# EasyEDA schematic SCH_The-Trail-Radio_2024-05-21.json
TITLE: Communication device; REV: 1.1; Date: 2024-05-07; Sheet: 1/1; Drawn By: J & Evan; Company: Hack club!
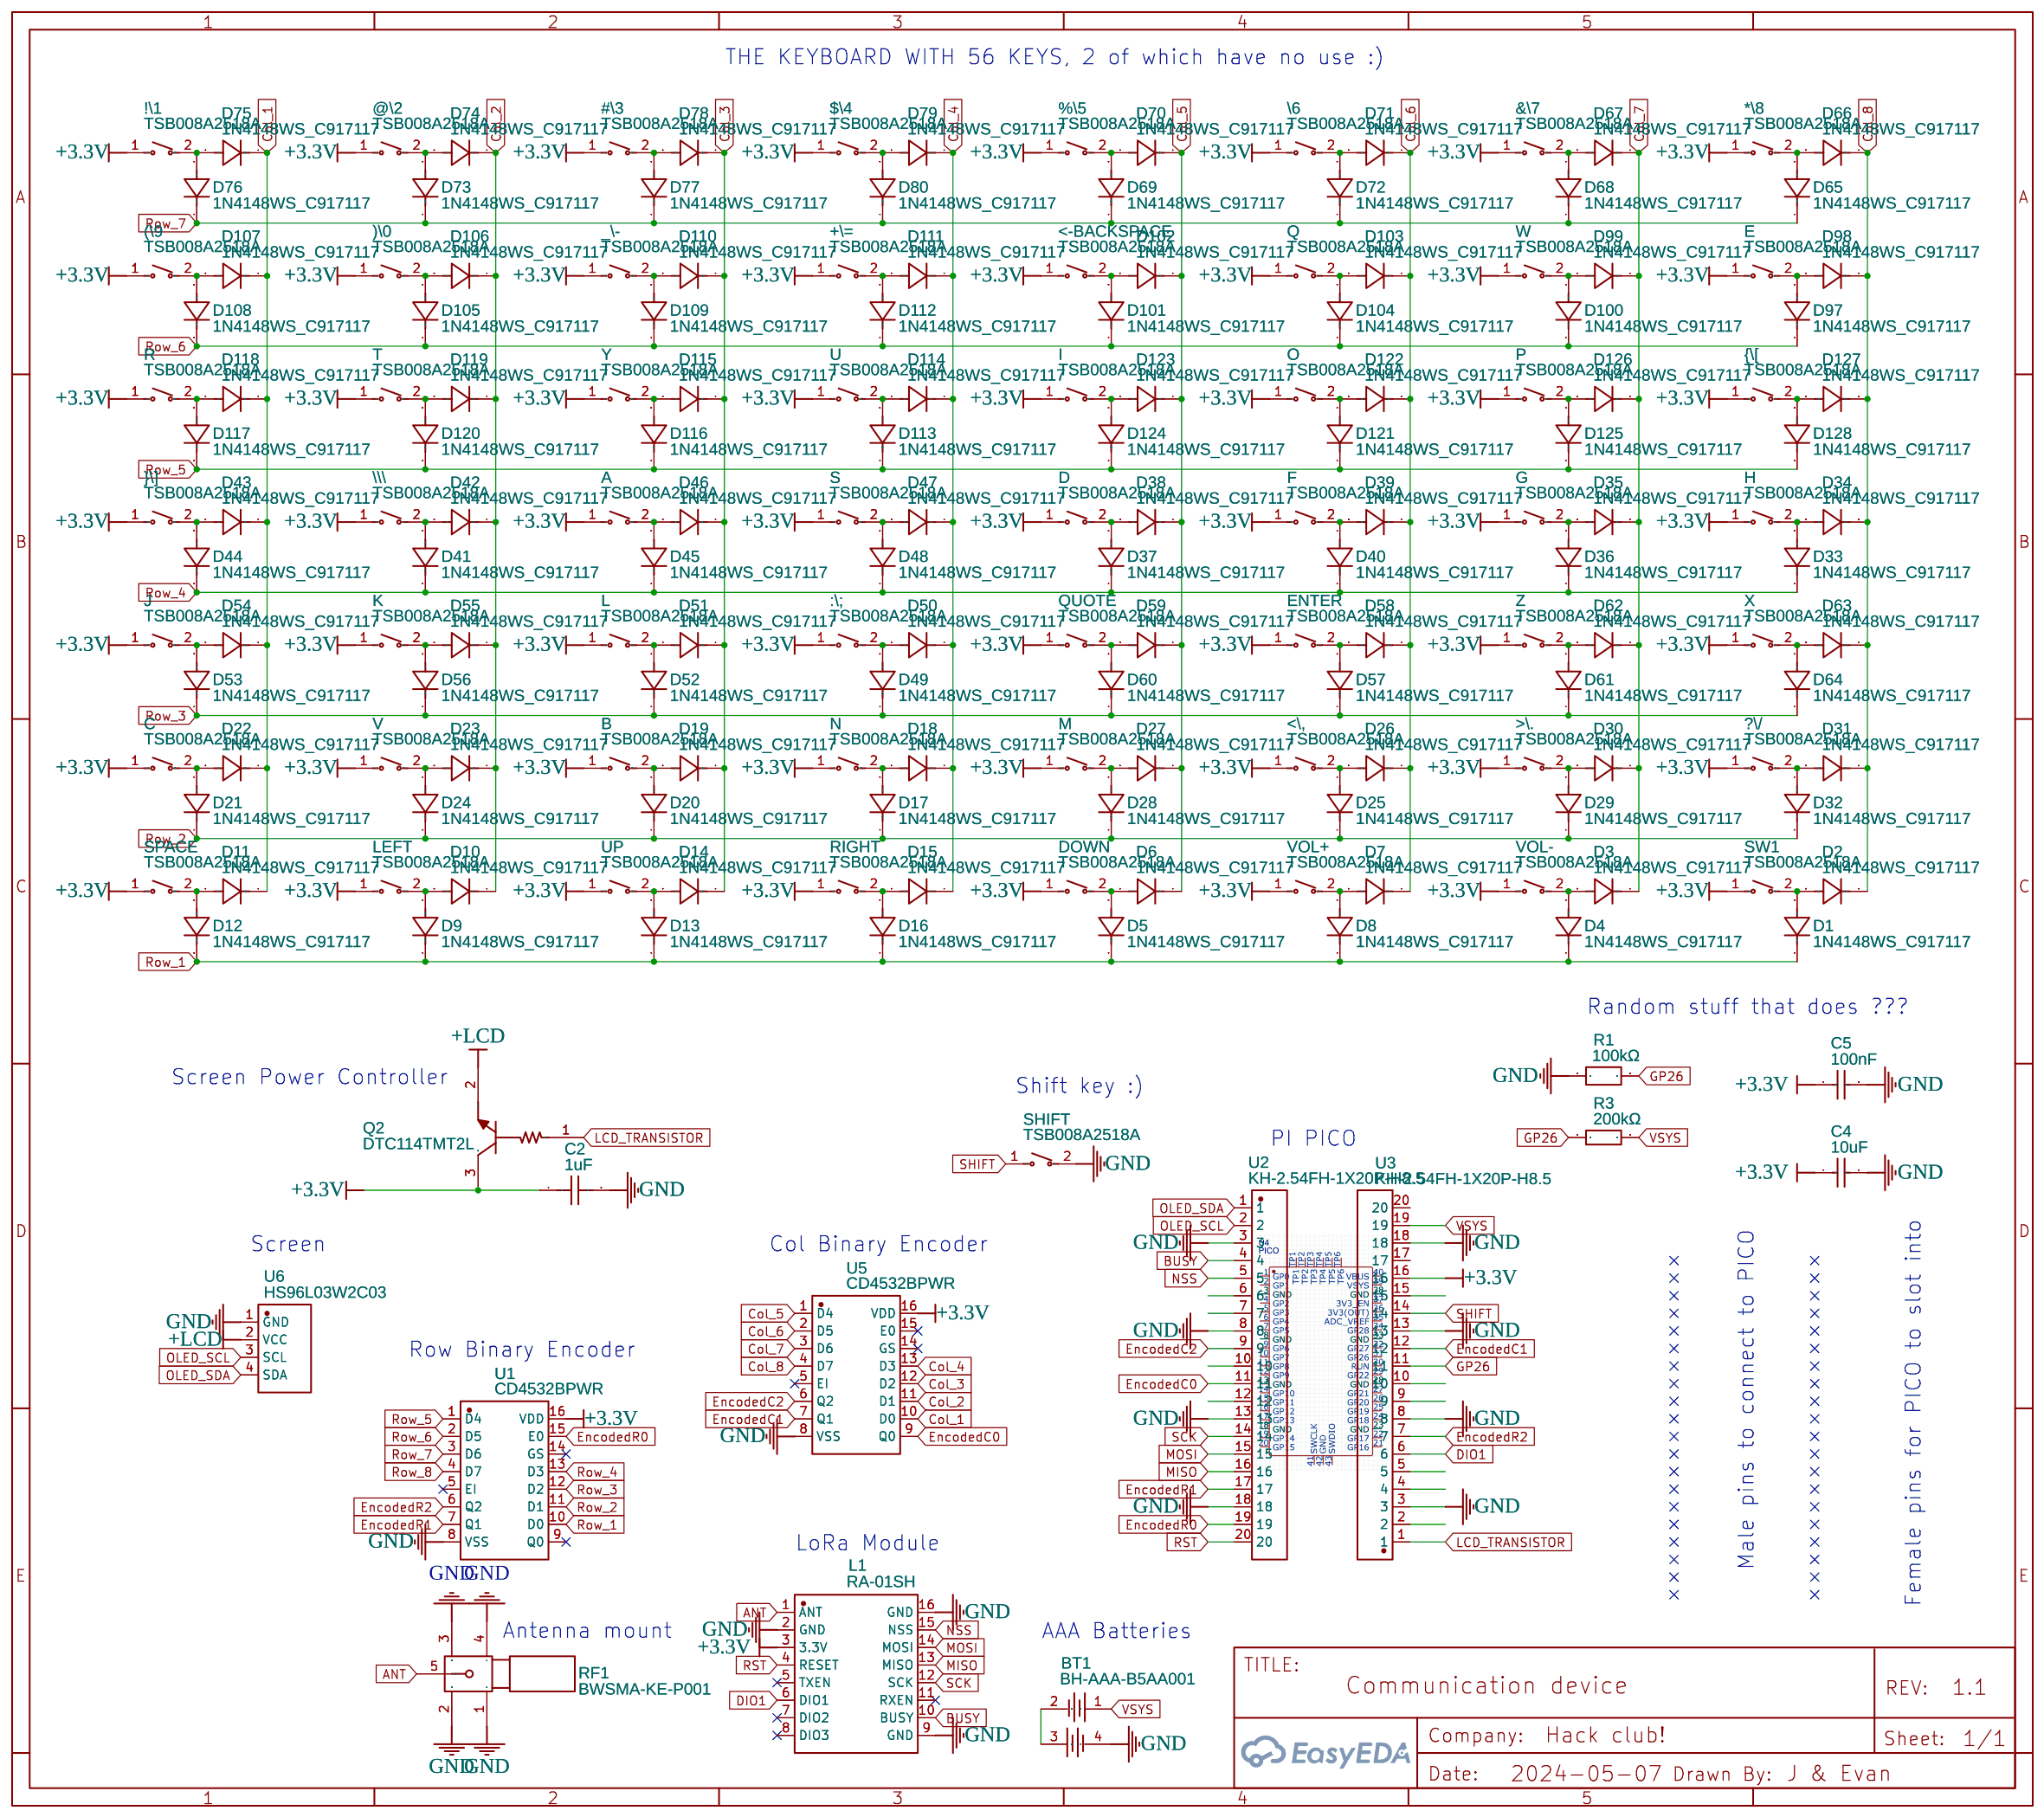
[diagram p0: schematic sheet]

## Parts
!\1  TSB008A2518A  [SW-SMD_L6.0-W3.5-LS8.2]
#\3  TSB008A2518A  [SW-SMD_L6.0-W3.5-LS8.2]
$\4  TSB008A2518A  [SW-SMD_L6.0-W3.5-LS8.2]
%\5  TSB008A2518A  [SW-SMD_L6.0-W3.5-LS8.2]
&\7  TSB008A2518A  [SW-SMD_L6.0-W3.5-LS8.2]
(\9  TSB008A2518A  [SW-SMD_L6.0-W3.5-LS8.2]
)\0  TSB008A2518A  [SW-SMD_L6.0-W3.5-LS8.2]
*\8  TSB008A2518A  [SW-SMD_L6.0-W3.5-LS8.2]
+\=  TSB008A2518A  [SW-SMD_L6.0-W3.5-LS8.2]
:\;  TSB008A2518A  [SW-SMD_L6.0-W3.5-LS8.2]
<-BACKSPACE  TSB008A2518A  [SW-SMD_L6.0-W3.5-LS8.2]
<\,  TSB008A2518A  [SW-SMD_L6.0-W3.5-LS8.2]
>\.  TSB008A2518A  [SW-SMD_L6.0-W3.5-LS8.2]
?\/  TSB008A2518A  [SW-SMD_L6.0-W3.5-LS8.2]
@\2  TSB008A2518A  [SW-SMD_L6.0-W3.5-LS8.2]
\6  TSB008A2518A  [SW-SMD_L6.0-W3.5-LS8.2]
\\\  TSB008A2518A  [SW-SMD_L6.0-W3.5-LS8.2]
_\-  TSB008A2518A  [SW-SMD_L6.0-W3.5-LS8.2]
A  TSB008A2518A  [SW-SMD_L6.0-W3.5-LS8.2]
B  TSB008A2518A  [SW-SMD_L6.0-W3.5-LS8.2]
BT1  BH-AAA-B5AA001  [BAT-SMD_BH-AAA-B5AA001]
C  TSB008A2518A  [SW-SMD_L6.0-W3.5-LS8.2]
C2  1uF  [C0402]
C4  10uF  [C0402]
C5  100nF  [C0402]
D  TSB008A2518A  [SW-SMD_L6.0-W3.5-LS8.2]
D1  1N4148WS_C917117  [SOD-323_L1.8-W1.3-LS2.5-RD]
D2  1N4148WS_C917117  [SOD-323_L1.8-W1.3-LS2.5-RD]
D3  1N4148WS_C917117  [SOD-323_L1.8-W1.3-LS2.5-RD]
D4  1N4148WS_C917117  [SOD-323_L1.8-W1.3-LS2.5-RD]
D5  1N4148WS_C917117  [SOD-323_L1.8-W1.3-LS2.5-RD]
D6  1N4148WS_C917117  [SOD-323_L1.8-W1.3-LS2.5-RD]
D7  1N4148WS_C917117  [SOD-323_L1.8-W1.3-LS2.5-RD]
D8  1N4148WS_C917117  [SOD-323_L1.8-W1.3-LS2.5-RD]
D9  1N4148WS_C917117  [SOD-323_L1.8-W1.3-LS2.5-RD]
D10  1N4148WS_C917117  [SOD-323_L1.8-W1.3-LS2.5-RD]
D11  1N4148WS_C917117  [SOD-323_L1.8-W1.3-LS2.5-RD]
D12  1N4148WS_C917117  [SOD-323_L1.8-W1.3-LS2.5-RD]
D13  1N4148WS_C917117  [SOD-323_L1.8-W1.3-LS2.5-RD]
D14  1N4148WS_C917117  [SOD-323_L1.8-W1.3-LS2.5-RD]
D15  1N4148WS_C917117  [SOD-323_L1.8-W1.3-LS2.5-RD]
D16  1N4148WS_C917117  [SOD-323_L1.8-W1.3-LS2.5-RD]
D17  1N4148WS_C917117  [SOD-323_L1.8-W1.3-LS2.5-RD]
D18  1N4148WS_C917117  [SOD-323_L1.8-W1.3-LS2.5-RD]
D19  1N4148WS_C917117  [SOD-323_L1.8-W1.3-LS2.5-RD]
D20  1N4148WS_C917117  [SOD-323_L1.8-W1.3-LS2.5-RD]
D21  1N4148WS_C917117  [SOD-323_L1.8-W1.3-LS2.5-RD]
D22  1N4148WS_C917117  [SOD-323_L1.8-W1.3-LS2.5-RD]
D23  1N4148WS_C917117  [SOD-323_L1.8-W1.3-LS2.5-RD]
D24  1N4148WS_C917117  [SOD-323_L1.8-W1.3-LS2.5-RD]
D25  1N4148WS_C917117  [SOD-323_L1.8-W1.3-LS2.5-RD]
D26  1N4148WS_C917117  [SOD-323_L1.8-W1.3-LS2.5-RD]
D27  1N4148WS_C917117  [SOD-323_L1.8-W1.3-LS2.5-RD]
D28  1N4148WS_C917117  [SOD-323_L1.8-W1.3-LS2.5-RD]
D29  1N4148WS_C917117  [SOD-323_L1.8-W1.3-LS2.5-RD]
D30  1N4148WS_C917117  [SOD-323_L1.8-W1.3-LS2.5-RD]
D31  1N4148WS_C917117  [SOD-323_L1.8-W1.3-LS2.5-RD]
D32  1N4148WS_C917117  [SOD-323_L1.8-W1.3-LS2.5-RD]
D33  1N4148WS_C917117  [SOD-323_L1.8-W1.3-LS2.5-RD]
D34  1N4148WS_C917117  [SOD-323_L1.8-W1.3-LS2.5-RD]
D35  1N4148WS_C917117  [SOD-323_L1.8-W1.3-LS2.5-RD]
D36  1N4148WS_C917117  [SOD-323_L1.8-W1.3-LS2.5-RD]
D37  1N4148WS_C917117  [SOD-323_L1.8-W1.3-LS2.5-RD]
D38  1N4148WS_C917117  [SOD-323_L1.8-W1.3-LS2.5-RD]
D39  1N4148WS_C917117  [SOD-323_L1.8-W1.3-LS2.5-RD]
D40  1N4148WS_C917117  [SOD-323_L1.8-W1.3-LS2.5-RD]
D41  1N4148WS_C917117  [SOD-323_L1.8-W1.3-LS2.5-RD]
D42  1N4148WS_C917117  [SOD-323_L1.8-W1.3-LS2.5-RD]
D43  1N4148WS_C917117  [SOD-323_L1.8-W1.3-LS2.5-RD]
D44  1N4148WS_C917117  [SOD-323_L1.8-W1.3-LS2.5-RD]
D45  1N4148WS_C917117  [SOD-323_L1.8-W1.3-LS2.5-RD]
D46  1N4148WS_C917117  [SOD-323_L1.8-W1.3-LS2.5-RD]
D47  1N4148WS_C917117  [SOD-323_L1.8-W1.3-LS2.5-RD]
D48  1N4148WS_C917117  [SOD-323_L1.8-W1.3-LS2.5-RD]
D49  1N4148WS_C917117  [SOD-323_L1.8-W1.3-LS2.5-RD]
D50  1N4148WS_C917117  [SOD-323_L1.8-W1.3-LS2.5-RD]
D51  1N4148WS_C917117  [SOD-323_L1.8-W1.3-LS2.5-RD]
D52  1N4148WS_C917117  [SOD-323_L1.8-W1.3-LS2.5-RD]
D53  1N4148WS_C917117  [SOD-323_L1.8-W1.3-LS2.5-RD]
D54  1N4148WS_C917117  [SOD-323_L1.8-W1.3-LS2.5-RD]
D55  1N4148WS_C917117  [SOD-323_L1.8-W1.3-LS2.5-RD]
D56  1N4148WS_C917117  [SOD-323_L1.8-W1.3-LS2.5-RD]
D57  1N4148WS_C917117  [SOD-323_L1.8-W1.3-LS2.5-RD]
D58  1N4148WS_C917117  [SOD-323_L1.8-W1.3-LS2.5-RD]
D59  1N4148WS_C917117  [SOD-323_L1.8-W1.3-LS2.5-RD]
D60  1N4148WS_C917117  [SOD-323_L1.8-W1.3-LS2.5-RD]
D61  1N4148WS_C917117  [SOD-323_L1.8-W1.3-LS2.5-RD]
D62  1N4148WS_C917117  [SOD-323_L1.8-W1.3-LS2.5-RD]
D63  1N4148WS_C917117  [SOD-323_L1.8-W1.3-LS2.5-RD]
D64  1N4148WS_C917117  [SOD-323_L1.8-W1.3-LS2.5-RD]
D65  1N4148WS_C917117  [SOD-323_L1.8-W1.3-LS2.5-RD]
D66  1N4148WS_C917117  [SOD-323_L1.8-W1.3-LS2.5-RD]
D67  1N4148WS_C917117  [SOD-323_L1.8-W1.3-LS2.5-RD]
D68  1N4148WS_C917117  [SOD-323_L1.8-W1.3-LS2.5-RD]
D69  1N4148WS_C917117  [SOD-323_L1.8-W1.3-LS2.5-RD]
D70  1N4148WS_C917117  [SOD-323_L1.8-W1.3-LS2.5-RD]
D71  1N4148WS_C917117  [SOD-323_L1.8-W1.3-LS2.5-RD]
D72  1N4148WS_C917117  [SOD-323_L1.8-W1.3-LS2.5-RD]
D73  1N4148WS_C917117  [SOD-323_L1.8-W1.3-LS2.5-RD]
D74  1N4148WS_C917117  [SOD-323_L1.8-W1.3-LS2.5-RD]
D75  1N4148WS_C917117  [SOD-323_L1.8-W1.3-LS2.5-RD]
D76  1N4148WS_C917117  [SOD-323_L1.8-W1.3-LS2.5-RD]
D77  1N4148WS_C917117  [SOD-323_L1.8-W1.3-LS2.5-RD]
D78  1N4148WS_C917117  [SOD-323_L1.8-W1.3-LS2.5-RD]
D79  1N4148WS_C917117  [SOD-323_L1.8-W1.3-LS2.5-RD]
D80  1N4148WS_C917117  [SOD-323_L1.8-W1.3-LS2.5-RD]
D97  1N4148WS_C917117  [SOD-323_L1.8-W1.3-LS2.5-RD]
D98  1N4148WS_C917117  [SOD-323_L1.8-W1.3-LS2.5-RD]
D99  1N4148WS_C917117  [SOD-323_L1.8-W1.3-LS2.5-RD]
D100  1N4148WS_C917117  [SOD-323_L1.8-W1.3-LS2.5-RD]
D101  1N4148WS_C917117  [SOD-323_L1.8-W1.3-LS2.5-RD]
D102  1N4148WS_C917117  [SOD-323_L1.8-W1.3-LS2.5-RD]
D103  1N4148WS_C917117  [SOD-323_L1.8-W1.3-LS2.5-RD]
D104  1N4148WS_C917117  [SOD-323_L1.8-W1.3-LS2.5-RD]
D105  1N4148WS_C917117  [SOD-323_L1.8-W1.3-LS2.5-RD]
D106  1N4148WS_C917117  [SOD-323_L1.8-W1.3-LS2.5-RD]
D107  1N4148WS_C917117  [SOD-323_L1.8-W1.3-LS2.5-RD]
D108  1N4148WS_C917117  [SOD-323_L1.8-W1.3-LS2.5-RD]
D109  1N4148WS_C917117  [SOD-323_L1.8-W1.3-LS2.5-RD]
D110  1N4148WS_C917117  [SOD-323_L1.8-W1.3-LS2.5-RD]
D111  1N4148WS_C917117  [SOD-323_L1.8-W1.3-LS2.5-RD]
D112  1N4148WS_C917117  [SOD-323_L1.8-W1.3-LS2.5-RD]
D113  1N4148WS_C917117  [SOD-323_L1.8-W1.3-LS2.5-RD]
D114  1N4148WS_C917117  [SOD-323_L1.8-W1.3-LS2.5-RD]
D115  1N4148WS_C917117  [SOD-323_L1.8-W1.3-LS2.5-RD]
D116  1N4148WS_C917117  [SOD-323_L1.8-W1.3-LS2.5-RD]
D117  1N4148WS_C917117  [SOD-323_L1.8-W1.3-LS2.5-RD]
D118  1N4148WS_C917117  [SOD-323_L1.8-W1.3-LS2.5-RD]
D119  1N4148WS_C917117  [SOD-323_L1.8-W1.3-LS2.5-RD]
D120  1N4148WS_C917117  [SOD-323_L1.8-W1.3-LS2.5-RD]
D121  1N4148WS_C917117  [SOD-323_L1.8-W1.3-LS2.5-RD]
D122  1N4148WS_C917117  [SOD-323_L1.8-W1.3-LS2.5-RD]
D123  1N4148WS_C917117  [SOD-323_L1.8-W1.3-LS2.5-RD]
D124  1N4148WS_C917117  [SOD-323_L1.8-W1.3-LS2.5-RD]
D125  1N4148WS_C917117  [SOD-323_L1.8-W1.3-LS2.5-RD]
D126  1N4148WS_C917117  [SOD-323_L1.8-W1.3-LS2.5-RD]
D127  1N4148WS_C917117  [SOD-323_L1.8-W1.3-LS2.5-RD]
D128  1N4148WS_C917117  [SOD-323_L1.8-W1.3-LS2.5-RD]
DOWN  TSB008A2518A  [SW-SMD_L6.0-W3.5-LS8.2]
E  TSB008A2518A  [SW-SMD_L6.0-W3.5-LS8.2]
ENTER  TSB008A2518A  [SW-SMD_L6.0-W3.5-LS8.2]
F  TSB008A2518A  [SW-SMD_L6.0-W3.5-LS8.2]
G  TSB008A2518A  [SW-SMD_L6.0-W3.5-LS8.2]
H  TSB008A2518A  [SW-SMD_L6.0-W3.5-LS8.2]
I  TSB008A2518A  [SW-SMD_L6.0-W3.5-LS8.2]
J  TSB008A2518A  [SW-SMD_L6.0-W3.5-LS8.2]
K  TSB008A2518A  [SW-SMD_L6.0-W3.5-LS8.2]
L  TSB008A2518A  [SW-SMD_L6.0-W3.5-LS8.2]
L1  RA-01SH  [WIRELM-SMD_RA-01SH]
LEFT  TSB008A2518A  [SW-SMD_L6.0-W3.5-LS8.2]
M  TSB008A2518A  [SW-SMD_L6.0-W3.5-LS8.2]
N  TSB008A2518A  [SW-SMD_L6.0-W3.5-LS8.2]
O  TSB008A2518A  [SW-SMD_L6.0-W3.5-LS8.2]
P  TSB008A2518A  [SW-SMD_L6.0-W3.5-LS8.2]
Q  TSB008A2518A  [SW-SMD_L6.0-W3.5-LS8.2]
Q2  DTC114TMT2L  [SOT-723-3_L1.2-W0.8-LS1.20-BR]
QUOTE  TSB008A2518A  [SW-SMD_L6.0-W3.5-LS8.2]
R  TSB008A2518A  [SW-SMD_L6.0-W3.5-LS8.2]
R1  100kΩ  [R0805]
R3  200kΩ  [R0402]
RF1  BWSMA-KE-P001  [SMA-SMD_BWSMA-KE-P001]
RIGHT  TSB008A2518A  [SW-SMD_L6.0-W3.5-LS8.2]
S  TSB008A2518A  [SW-SMD_L6.0-W3.5-LS8.2]
SHIFT  TSB008A2518A  [SW-SMD_L6.0-W3.5-LS8.2]
SPACE  TSB008A2518A  [SW-SMD_L6.0-W3.5-LS8.2]
SW1  TSB008A2518A  [SW-SMD_L6.0-W3.5-LS8.2]
T  TSB008A2518A  [SW-SMD_L6.0-W3.5-LS8.2]
U  TSB008A2518A  [SW-SMD_L6.0-W3.5-LS8.2]
U1  CD4532BPWR  [TSSOP-16_L5.0-W4.4-P0.65-LS6.4-BL]
U2  KH-2.54FH-1X20P-H8.5  [HDR-TH_20P-P2.54-V-F-2]
U3  KH-2.54FH-1X20P-H8.5  [HDR-TH_20P-P2.54-V-F-2]
U5  CD4532BPWR  [TSSOP-16_L5.0-W4.4-P0.65-LS6.4-BL]
U6  HS96L03W2C03  [OLED-TH_L27.8-W27.2-P2.54_C9900033791]
UP  TSB008A2518A  [SW-SMD_L6.0-W3.5-LS8.2]
V  TSB008A2518A  [SW-SMD_L6.0-W3.5-LS8.2]
VOL+  TSB008A2518A  [SW-SMD_L6.0-W3.5-LS8.2]
VOL-  TSB008A2518A  [SW-SMD_L6.0-W3.5-LS8.2]
W  TSB008A2518A  [SW-SMD_L6.0-W3.5-LS8.2]
X  TSB008A2518A  [SW-SMD_L6.0-W3.5-LS8.2]
Y  TSB008A2518A  [SW-SMD_L6.0-W3.5-LS8.2]
Z  TSB008A2518A  [SW-SMD_L6.0-W3.5-LS8.2]
{\[  TSB008A2518A  [SW-SMD_L6.0-W3.5-LS8.2]
}\]  TSB008A2518A  [SW-SMD_L6.0-W3.5-LS8.2]

## Library data of the parts
!\1 #\3 $\4 %\5 &\7 (\9 )\0 *\8 +\= :\; <-BACKSPACE <\, >\. ?\/ @\2 \6 \\\ _\- A B C D DOWN E ENTER F G H I J K L LEFT M N O P Q QUOTE R RIGHT S SHIFT SPACE SW1 T U UP V VOL+ VOL- W X Y Z {\[ }\] = TSB008A2518A: Contributor: LCSC; Supplier: LCSC; Supplier Part: C2888455; Manufacturer: BZCN(博众电气); JLCPCB Part Class: Extended Part
BT1 = BH-AAA-B5AA001: Contributor: LCSC; Supplier: LCSC; Supplier Part: C964881; Manufacturer: MYOUNG(美阳); JLCPCB Part Class: Extended Part
C2 = CL05A105KA5NQNC: Supplier: LCSC; Manufacturer: SAMSUNG(三星); Supplier Part: C52923; JLCPCB Part Class: Basic Part
C4 = CL05A106MQ5NUNC: Supplier: LCSC; Manufacturer: SAMSUNG(三星); Supplier Part: C15525; JLCPCB Part Class: Basic Part
C5 = CL05B104KO5NNNC: Supplier: LCSC; Manufacturer: SAMSUNG(三星); Supplier Part: C1525; JLCPCB Part Class: Basic Part
D1-D80 D97-D128 = 1N4148WS_C917117: Contributor: LCSC; Supplier: LCSC; Supplier Part: C917117; Manufacturer: JSMSEMI(杰盛微); Manufacturer Part: 1N4148WS; JLCPCB Part Class: Extended Part
L1 = RA-01SH: Contributor: LCSC; Supplier: LCSC; Supplier Part: C2764087; Manufacturer: Ai-Thinker(安信可); Manufacturer Part: Ra-01SH; JLCPCB Part Class: Extended Part
Q2 = DTC114TMT2L: Contributor: LCSC; Supplier: LCSC; Supplier Part: C2889117; Manufacturer: ROHM(罗姆); JLCPCB Part Class: Extended Part
R1 = SCR0805J100K: Contributor: lcsc; Supplier: LCSC; Supplier Part: C3017875; Manufacturer: VO(翔胜); JLCPCB Part Class: Extended Part
R3 = 0402WGF2003TCE: Supplier: LCSC; Manufacturer: UNI-ROYAL(厚声); Supplier Part: C25764; JLCPCB Part Class: Basic Part
RF1 = BWSMA-KE-P001: Contributor: LCSC; Supplier: LCSC; Supplier Part: C496550; Manufacturer: BAT WIRELESS(蝙蝠无线); JLCPCB Part Class: Extended Part
U1 U5 = CD4532BPWR: Contributor: LCSC; Supplier: LCSC; Supplier Part: C2682017; Manufacturer: TI(德州仪器); JLCPCB Part Class: Extended Part
U2 U3 = KH-2.54FH-1X20P-H8.5: Contributor: LCSC; Supplier: LCSC; Supplier Part: C2905423; Manufacturer: kinghelm(金航标); JLCPCB Part Class: Extended Part
U6 = HS96L03W2C03: Contributor: lcsc; Supplier: LCSC; Supplier Part: C5248080; Manufacturer: HS(汉昇); JLCPCB Part Class: Extended Part

## Nets
+3.3V: !\1.1 #\3.1 $\4.1 %\5.1 &\7.1 (\9.1 )\0.1 *\8.1 +\=.1 :\;.1 <-BACKSPACE.1 <\,.1 >\..1 ?\/.1 @\2.1 \6.1 \\\.1 _\-.1 A.1 B.1 C.1 C2.1 C4.1 C5.1 D.1 DOWN.1 E.1 ENTER.1 F.1 G.1 H.1 I.1 J.1 K.1 L.1 L1.3(3.3V) LEFT.1 M.1 N.1 O.1 P.1 Q.1 Q2.3(C) QUOTE.1 R.1 RIGHT.1 S.1 SPACE.1 SW1.1 T.1 U.1 U1.16(VDD) U3.16 U5.16(VDD) UP.1 V.1 VOL+.1 VOL-.1 W.1 X.1 Y.1 Z.1 {\[.1 }\].1
GND: BT1.4 C2.2 C4.2 C5.2 L1.2(GND) L1.9(GND) L1.16(GND) R1.1 RF1.1 RF1.2 RF1.3 RF1.4 SHIFT.2 U1.8(VSS) U2.3 U2.8 U2.13 U2.18 U3.3 U3.8 U3.13 U3.18 U5.8(VSS) U6.1(GND)
+LCD: Q2.2(E) U6.2(VCC)
ANT: L1.1(ANT) RF1.5
BUSY: L1.10(BUSY) U2.4
Col_1: D11.1(C) D22.1(C) D43.1(C) D54.1(C) D75.1(C) D107.1(C) D118.1(C) U5.10(D0)
Col_2: D10.1(C) D23.1(C) D42.1(C) D55.1(C) D74.1(C) D106.1(C) D119.1(C) U5.11(D1)
Col_3: D14.1(C) D19.1(C) D46.1(C) D51.1(C) D78.1(C) D110.1(C) D115.1(C) U5.12(D2)
Col_4: D15.1(C) D18.1(C) D47.1(C) D50.1(C) D79.1(C) D111.1(C) D114.1(C) U5.13(D3)
Col_5: D6.1(C) D27.1(C) D38.1(C) D59.1(C) D70.1(C) D102.1(C) D123.1(C) U5.1(D4)
Col_6: D7.1(C) D26.1(C) D39.1(C) D58.1(C) D71.1(C) D103.1(C) D122.1(C) U5.2(D5)
Col_7: D3.1(C) D30.1(C) D35.1(C) D62.1(C) D67.1(C) D99.1(C) D126.1(C) U5.3(D6)
Col_8: D2.1(C) D31.1(C) D34.1(C) D63.1(C) D66.1(C) D98.1(C) D127.1(C) U5.4(D7)
DIO1: L1.6(DIO1) U3.6
EncodedC0: U2.11 U5.9(Q0)
EncodedC1: U3.12 U5.7(Q1)
EncodedC2: U2.9 U5.6(Q2)
EncodedR0: U1.15(E0) U2.19
EncodedR1: U1.7(Q1) U2.17
EncodedR2: U1.6(Q2) U3.7
GP26: R1.2 R3.1 U3.11
LCD_TRANSISTOR: Q2.1(B) U3.1
MISO: L1.13(MISO) U2.16
MOSI: L1.14(MOSI) U2.15
NSS: L1.15(NSS) U2.5
OLED_SCL: U2.2 U6.3(SCL)
OLED_SDA: U2.1 U6.4(SDA)
Row_1: D1.1(C) D4.1(C) D5.1(C) D8.1(C) D9.1(C) D12.1(C) D13.1(C) D16.1(C) U1.10(D0)
Row_2: D17.1(C) D20.1(C) D21.1(C) D24.1(C) D25.1(C) D28.1(C) D29.1(C) D32.1(C) U1.11(D1)
Row_3: D49.1(C) D52.1(C) D53.1(C) D56.1(C) D57.1(C) D60.1(C) D61.1(C) D64.1(C) U1.12(D2)
Row_4: D33.1(C) D36.1(C) D37.1(C) D40.1(C) D41.1(C) D44.1(C) D45.1(C) D48.1(C) U1.13(D3)
Row_5: D113.1(C) D116.1(C) D117.1(C) D120.1(C) D121.1(C) D124.1(C) D125.1(C) D128.1(C) U1.1(D4)
Row_6: D97.1(C) D100.1(C) D101.1(C) D104.1(C) D105.1(C) D108.1(C) D109.1(C) D112.1(C) U1.2(D5)
Row_7: D65.1(C) D68.1(C) D69.1(C) D72.1(C) D73.1(C) D76.1(C) D77.1(C) D80.1(C) U1.3(D6)
Row_8: U1.4(D7)
RST: L1.4(RESET) U2.20
SCK: L1.12(SCK) U2.14
SHIFT: SHIFT.1 U3.14
VSYS: BT1.1 R3.2 U3.19
Net-(!\1-2): !\1.2 D75.2(A) D76.2(A)
Net-(#\3-2): #\3.2 D77.2(A) D78.2(A)
Net-($\4-2): $\4.2 D79.2(A) D80.2(A)
Net-(%\5-2): %\5.2 D69.2(A) D70.2(A)
Net-(&\7-2): &\7.2 D67.2(A) D68.2(A)
Net-((\9-2): (\9.2 D107.2(A) D108.2(A)
Net-()\0-2): )\0.2 D105.2(A) D106.2(A)
Net-(*\8-2): *\8.2 D65.2(A) D66.2(A)
Net-(+\=-2): +\=.2 D111.2(A) D112.2(A)
Net-(:\;-2): :\;.2 D49.2(A) D50.2(A)
Net-(<-BACKSPACE-2): <-BACKSPACE.2 D101.2(A) D102.2(A)
Net-(<\,-2): <\,.2 D25.2(A) D26.2(A)
Net-(>\.-2): >\..2 D29.2(A) D30.2(A)
Net-(?\/-2): ?\/.2 D31.2(A) D32.2(A)
Net-(@\2-2): @\2.2 D73.2(A) D74.2(A)
Net-(\6-2): \6.2 D71.2(A) D72.2(A)
Net-(\\\-2): \\\.2 D41.2(A) D42.2(A)
Net-(_\--2): _\-.2 D109.2(A) D110.2(A)
Net-(A-2): A.2 D45.2(A) D46.2(A)
Net-(B-2): B.2 D19.2(A) D20.2(A)
Net-(BT1-2): BT1.2 BT1.3
Net-(C-2): C.2 D21.2(A) D22.2(A)
Net-(D1-2): D1.2(A) D2.2(A) SW1.2
Net-(D3-2): D3.2(A) D4.2(A) VOL-.2
Net-(D5-2): D5.2(A) D6.2(A) DOWN.2
Net-(D7-2): D7.2(A) D8.2(A) VOL+.2
Net-(D9-2): D9.2(A) D10.2(A) LEFT.2
Net-(D11-2): D11.2(A) D12.2(A) SPACE.2
Net-(D13-2): D13.2(A) D14.2(A) UP.2
Net-(D15-2): D15.2(A) D16.2(A) RIGHT.2
Net-(D17-2): D17.2(A) D18.2(A) N.2
Net-(D23-2): D23.2(A) D24.2(A) V.2
Net-(D27-2): D27.2(A) D28.2(A) M.2
Net-(D33-2): D33.2(A) D34.2(A) H.2
Net-(D35-2): D35.2(A) D36.2(A) G.2
Net-(D39-2): D39.2(A) D40.2(A) F.2
Net-(D43-2): D43.2(A) D44.2(A) }\].2
Net-(D47-2): D47.2(A) D48.2(A) S.2
Net-(D51-2): D51.2(A) D52.2(A) L.2
Net-(D53-2): D53.2(A) D54.2(A) J.2
Net-(D55-2): D55.2(A) D56.2(A) K.2
Net-(D57-2): D57.2(A) D58.2(A) ENTER.2
Net-(D59-2): D59.2(A) D60.2(A) QUOTE.2
Net-(D61-2): D61.2(A) D62.2(A) Z.2
Net-(D63-2): D63.2(A) D64.2(A) X.2
Net-(D97-2): D97.2(A) D98.2(A) E.2
Net-(D99-2): D99.2(A) D100.2(A) W.2
Net-(D103-2): D103.2(A) D104.2(A) Q.2
Net-(D113-2): D113.2(A) D114.2(A) U.2
Net-(D115-2): D115.2(A) D116.2(A) Y.2
Net-(D117-2): D117.2(A) D118.2(A) R.2
Net-(D119-2): D119.2(A) D120.2(A) T.2
Net-(D121-2): D121.2(A) D122.2(A) O.2
Net-(D123-2): D123.2(A) D124.2(A) I.2
Net-(D125-2): D125.2(A) D126.2(A) P.2
Net-(D127-2): D127.2(A) D128.2(A) {\[.2
Net-(D-2): D.2 D37.2(A) D38.2(A)

Not connected (* = marked no-connect by the designer): L1 5(TXEN)* 7(DIO2)* 8(DIO3)* 11(RXEN)*; U1 5(EI)* 9(Q0)* 14(GS)*; U2 6 7 10 12; U3 2 4 5 9 10 15 17 20; U5 5(EI)* 14(GS)* 15(E0)*

## Notes on the sheet
- THE KEYBOARD WITH 56 KEYS, 2 of which have no use :)
- Random stuff that does ???
- Screen Power Controller
- Shift key :)
- PI PICO
- Screen
- Col Binary Encoder
- Row Binary Encoder
- LoRa Module
- Male pins to connect to PICO
- Female pins for PICO to slot into
- Antenna mount
- AAA Batteries
